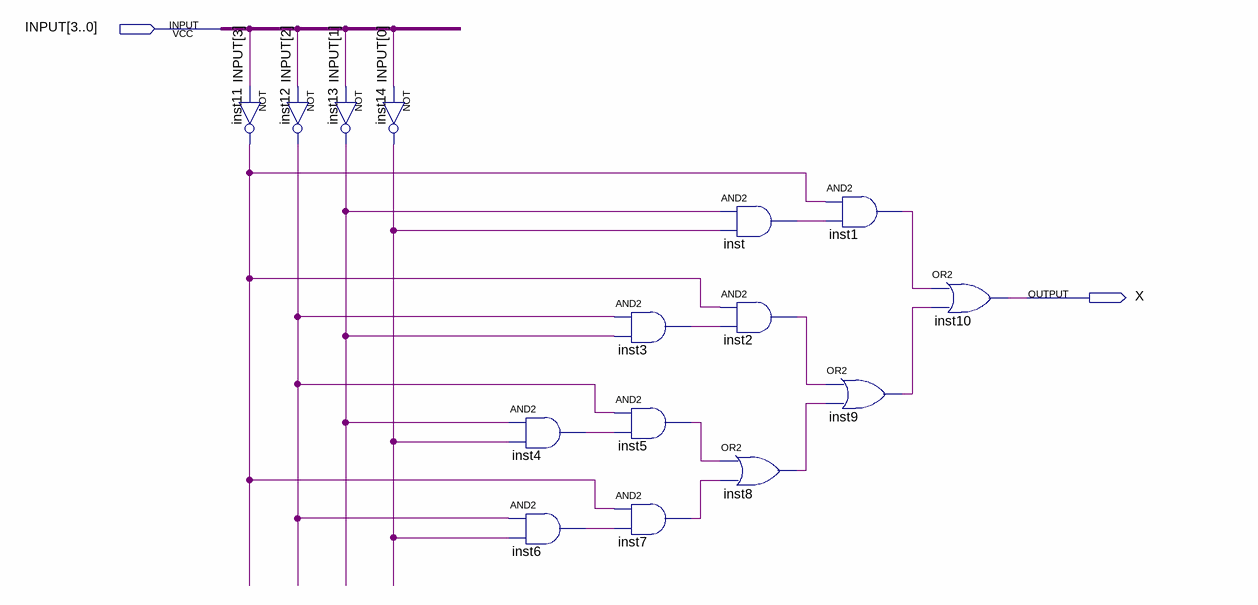
[diagram p0: schematic sheet]
// Quartus schematic pr1.bdf as structural Verilog: 15 symbols, 2 pins
module pr1 (
  input  [3:0] INPUT,
  output X
);

  wire inst1_out, inst2_out, inst3_out, inst4_out, inst5_out, inst6_out, inst7_out, inst8_out, inst9_out,
       inst11_out, inst12_out, inst13_out, inst14_out, inst_out;

  not inst11 (inst11_out, INPUT[3]);
  not inst12 (inst12_out, INPUT[2]);
  not inst13 (inst13_out, INPUT[1]);
  not inst14 (inst14_out, INPUT[0]);
  and inst4 (inst4_out, inst13_out, inst14_out);
  and inst6 (inst6_out, inst12_out, inst14_out);
  and inst3 (inst3_out, inst12_out, inst13_out);
  and inst5 (inst5_out, inst12_out, inst4_out);
  and inst7 (inst7_out, inst11_out, inst6_out);
  and inst (inst_out, inst13_out, inst14_out);
  and inst2 (inst2_out, inst11_out, inst3_out);
  or inst8 (inst8_out, inst5_out, inst7_out);
  and inst1 (inst1_out, inst11_out, inst_out);
  or inst9 (inst9_out, inst2_out, inst8_out);
  or inst10 (X, inst1_out, inst9_out);
endmodule
